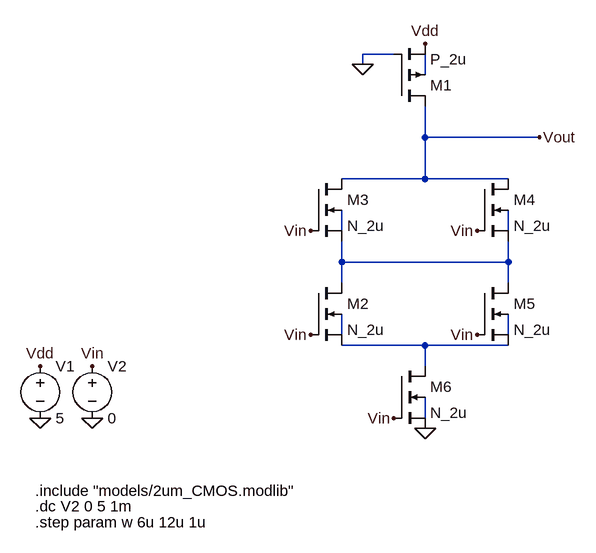
[diagram p0: schematic 3a.asc]
3a.asc, the LTspice schematic file:
Version 4
SHEET 1 1224 680
WIRE 128 -256 80 -256
WIRE 80 -240 80 -256
WIRE 176 -224 176 -256
WIRE 176 -128 176 -176
WIRE 352 -128 176 -128
WIRE 176 -64 176 -128
WIRE 176 -64 48 -64
WIRE 304 -64 176 -64
WIRE 48 16 48 -16
WIRE 304 16 304 -16
WIRE 48 64 48 32
WIRE 304 64 304 32
WIRE 304 64 48 64
WIRE 48 96 48 64
WIRE 304 96 304 64
WIRE 48 176 48 144
WIRE 304 176 304 144
WIRE 176 192 48 192
WIRE 304 192 176 192
WIRE 176 224 176 192
WIRE 176 304 176 272
FLAG 80 -240 0
FLAG 176 320 0
FLAG 176 -272 Vdd
FLAG 352 -128 Vout
FLAG -336 224 Vin
FLAG -416 224 Vdd
FLAG -416 304 0
FLAG -336 304 0
FLAG 0 176 Vin
FLAG 0 16 Vin
FLAG 256 16 Vin
FLAG 256 176 Vin
FLAG 128 304 Vin
SYMBOL pmos4 128 -176 M180
SYMATTR InstName M1
SYMATTR Value P_2u
SYMATTR Value2 l=2u w={w}
SYMBOL nmos4 0 -64 R0
SYMATTR InstName M3
SYMATTR Value N_2u
SYMATTR Value2 l=2u w=12u
SYMBOL nmos4 0 96 R0
SYMATTR InstName M2
SYMATTR Value N_2u
SYMATTR Value2 l=2u w=12u
SYMBOL nmos4 256 -64 R0
SYMATTR InstName M4
SYMATTR Value N_2u
SYMATTR Value2 l=2u w=12u
SYMBOL nmos4 256 96 R0
SYMATTR InstName M5
SYMATTR Value N_2u
SYMATTR Value2 l=2u w=12u
SYMBOL nmos4 128 224 R0
SYMATTR InstName M6
SYMATTR Value N_2u
SYMATTR Value2 l=2u w=12u
SYMBOL voltage -416 208 R0
WINDOW 123 0 0 Left 0
WINDOW 39 0 0 Left 0
SYMATTR InstName V1
SYMATTR Value 5
SYMBOL voltage -336 208 R0
WINDOW 123 0 0 Left 0
WINDOW 39 0 0 Left 0
SYMATTR InstName V2
SYMATTR Value 0
TEXT -424 416 Left 2 !.include "models/2um_CMOS.modlib"
TEXT -424 440 Left 2 !.dc V2 0 5 1m
TEXT -424 464 Left 2 !.step param w 6u 12u 1u

The netlist it stands for:
* 3a.asc
M1 Vout 0 Vdd N001 P_2u l=2u w={w}
M3 Vout Vin N004 N002 N_2u l=2u w=12u
M2 N004 Vin N007 N005 N_2u l=2u w=12u
M4 Vout Vin N004 N003 N_2u l=2u w=12u
M5 N004 Vin N007 N006 N_2u l=2u w=12u
M6 N007 Vin 0 N008 N_2u l=2u w=12u
V1 Vdd 0 5
V2 Vin 0 0
.model NMOS NMOS
.model PMOS PMOS
.lib standard.mos
.include "models/2um_CMOS.modlib"
.dc V2 0 5 1m
.step param w 6u 12u 1u
.backanno
.end